# Altium schematic sheet AddressBUS.SchDoc
size A0; SheetNumber: 9; SheetTotal: 9
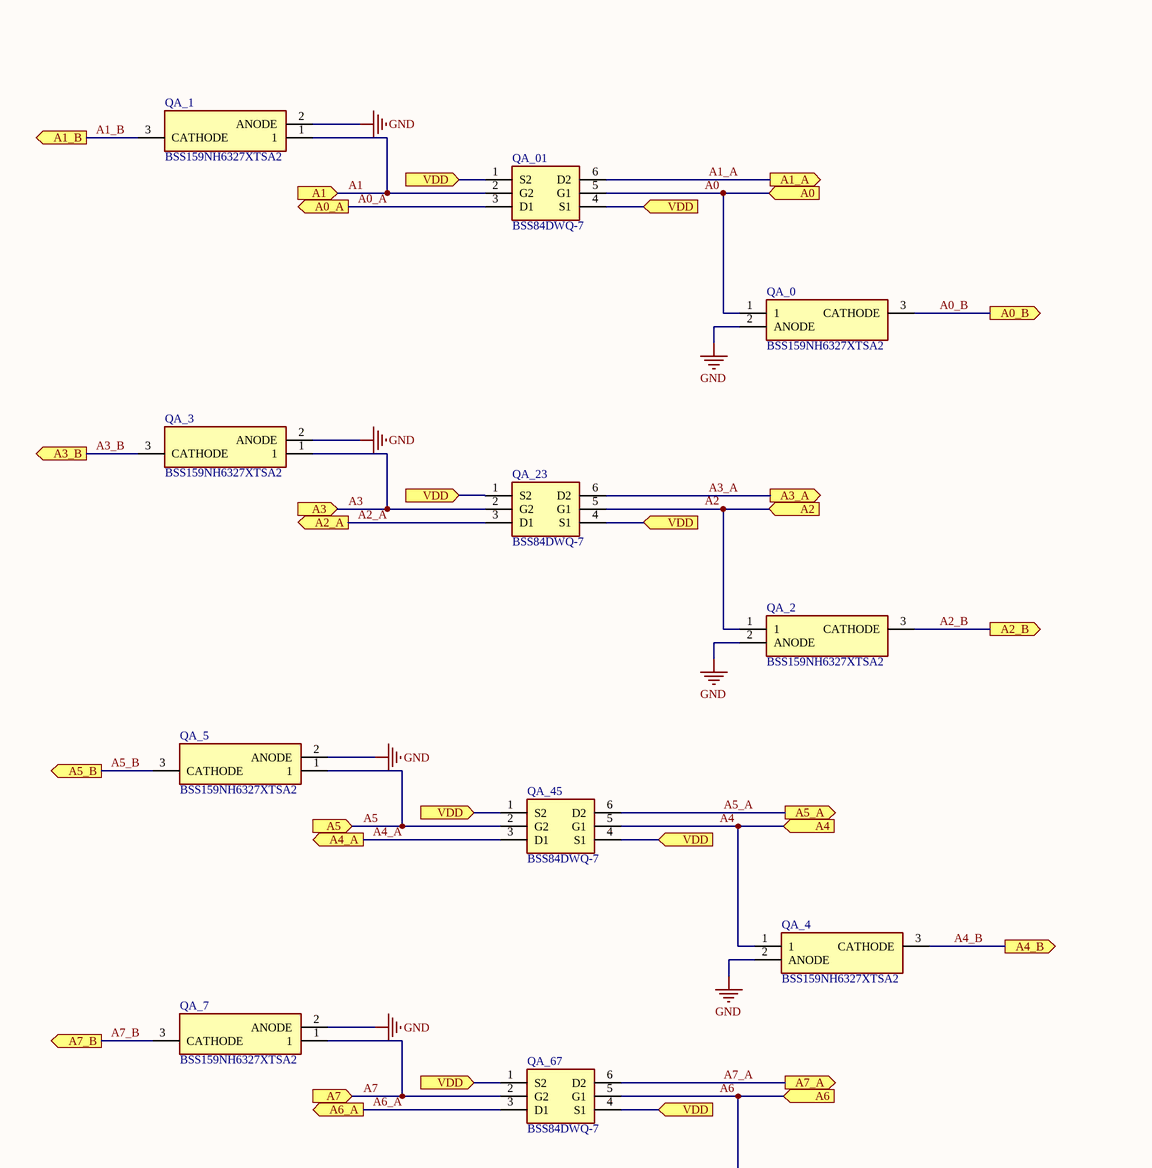
[diagram p0: AddressBUS.SchDoc, top left]
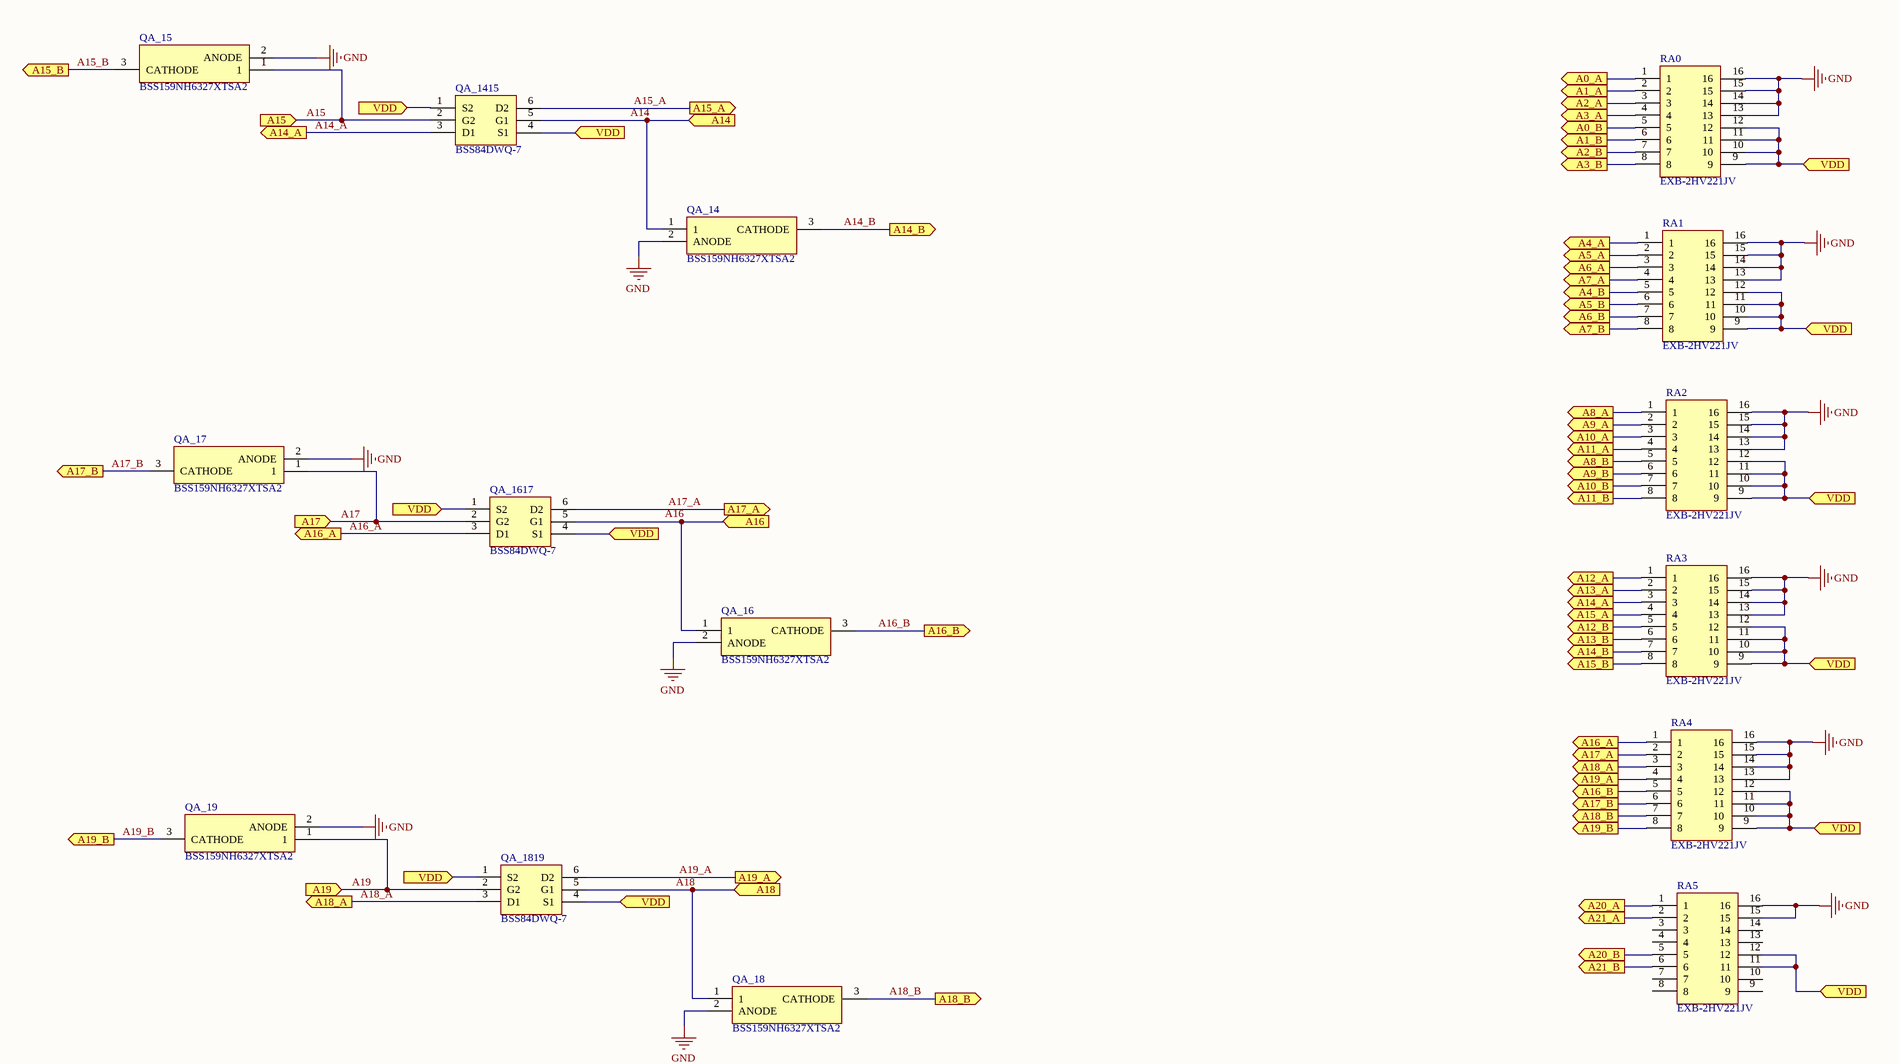
[diagram p1: AddressBUS.SchDoc, top right]
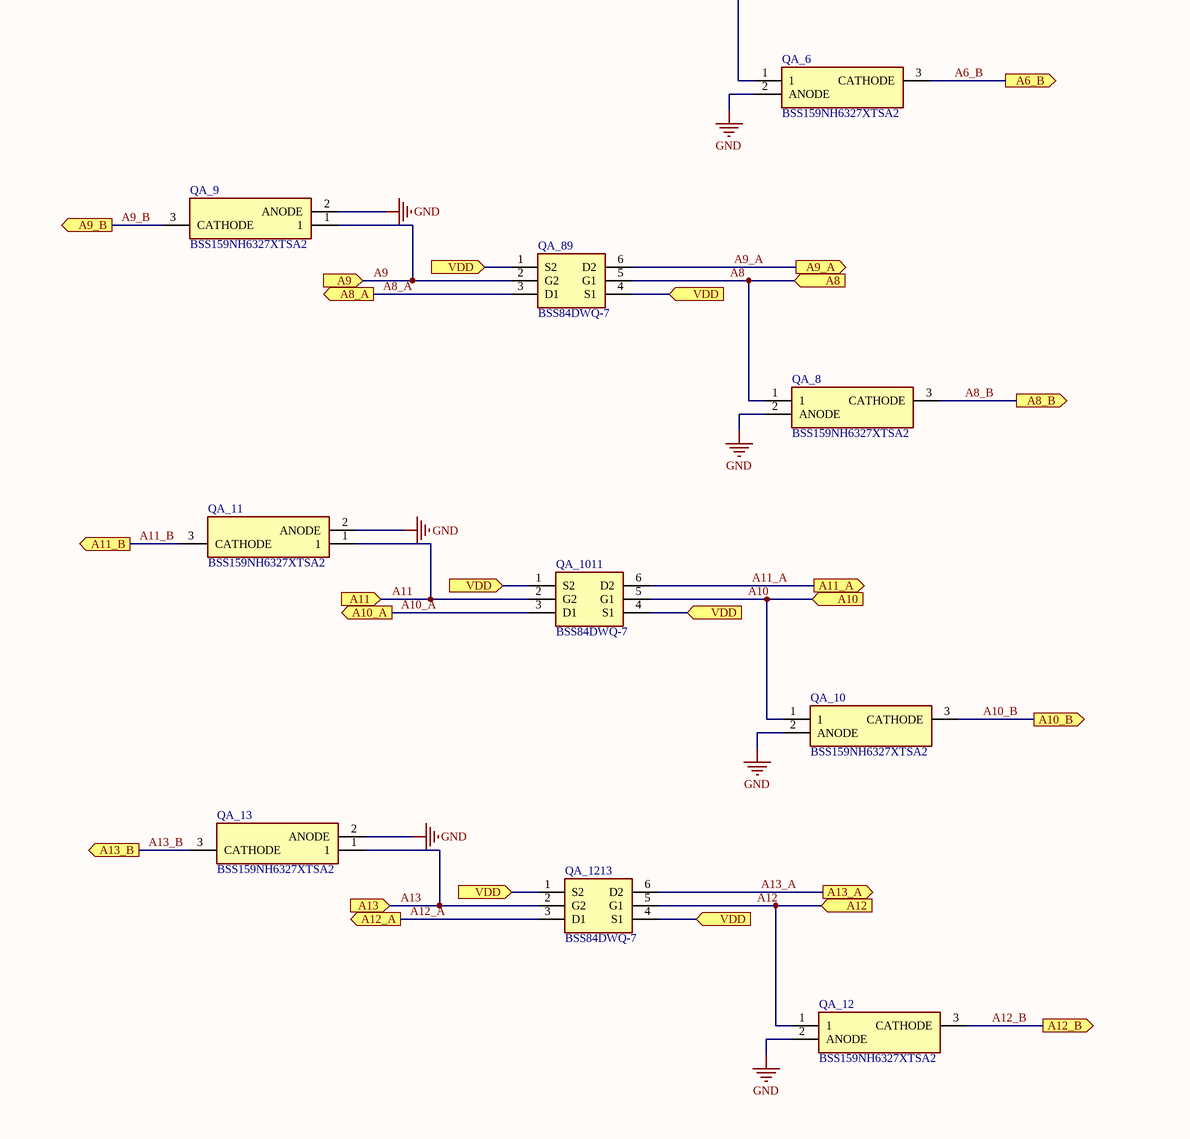
[diagram p2: AddressBUS.SchDoc, bottom left]
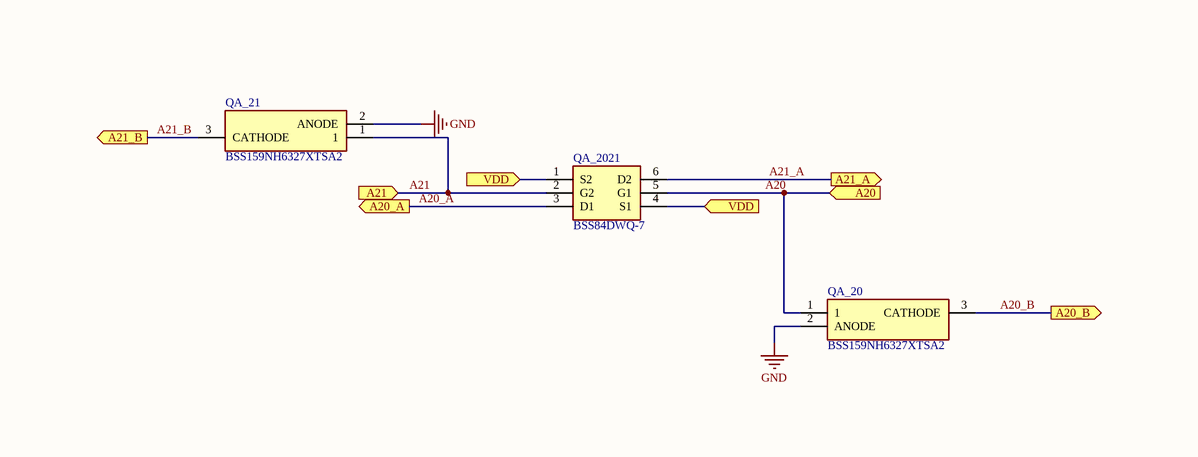
[diagram p3: AddressBUS.SchDoc, bottom right]

## Parts
QA_0  BSS159NH6327XTSA2  [SOT95P260X110-3N]
QA_01  BSS84DWQ-7  [SOT65P210X110-6N]
QA_1  BSS159NH6327XTSA2  [SOT95P260X110-3N]
QA_2  BSS159NH6327XTSA2  [SOT95P260X110-3N]
QA_3  BSS159NH6327XTSA2  [SOT95P260X110-3N]
QA_4  BSS159NH6327XTSA2  [SOT95P260X110-3N]
QA_5  BSS159NH6327XTSA2  [SOT95P260X110-3N]
QA_6  BSS159NH6327XTSA2  [SOT95P260X110-3N]
QA_7  BSS159NH6327XTSA2  [SOT95P260X110-3N]
QA_8  BSS159NH6327XTSA2  [SOT95P260X110-3N]
QA_9  BSS159NH6327XTSA2  [SOT95P260X110-3N]
QA_10  BSS159NH6327XTSA2  [SOT95P260X110-3N]
QA_11  BSS159NH6327XTSA2  [SOT95P260X110-3N]
QA_12  BSS159NH6327XTSA2  [SOT95P260X110-3N]
QA_13  BSS159NH6327XTSA2  [SOT95P260X110-3N]
QA_14  BSS159NH6327XTSA2  [SOT95P260X110-3N]
QA_15  BSS159NH6327XTSA2  [SOT95P260X110-3N]
QA_16  BSS159NH6327XTSA2  [SOT95P260X110-3N]
QA_17  BSS159NH6327XTSA2  [SOT95P260X110-3N]
QA_18  BSS159NH6327XTSA2  [SOT95P260X110-3N]
QA_19  BSS159NH6327XTSA2  [SOT95P260X110-3N]
QA_20  BSS159NH6327XTSA2  [SOT95P260X110-3N]
QA_21  BSS159NH6327XTSA2  [SOT95P260X110-3N]
QA_23  BSS84DWQ-7  [SOT65P210X110-6N]
QA_45  BSS84DWQ-7  [SOT65P210X110-6N]
QA_67  BSS84DWQ-7  [SOT65P210X110-6N]
QA_89  BSS84DWQ-7  [SOT65P210X110-6N]
QA_1011  BSS84DWQ-7  [SOT65P210X110-6N]
QA_1213  BSS84DWQ-7  [SOT65P210X110-6N]
QA_1415  BSS84DWQ-7  [SOT65P210X110-6N]
QA_1617  BSS84DWQ-7  [SOT65P210X110-6N]
QA_1819  BSS84DWQ-7  [SOT65P210X110-6N]
QA_2021  BSS84DWQ-7  [SOT65P210X110-6N]
RA0  EXB-2HV221JV  [EXB2HV221JV]
RA1  EXB-2HV221JV  [EXB2HV221JV]
RA2  EXB-2HV221JV  [EXB2HV221JV]
RA3  EXB-2HV221JV  [EXB2HV221JV]
RA4  EXB-2HV221JV  [EXB2HV221JV]
RA5  EXB-2HV221JV  [EXB2HV221JV]

## Ports
A0 (in), A0_A (out), A0_B (out), A1 (in), A1_A (out), A1_B (out), A2 (in), A2_A (out), A2_B (out), A3 (in), A3_A (out), A3_B (out), A4 (in), A4_A (out), A4_B (out), A5 (in), A5_A (out), A5_B (out), A6 (in), A6_A (out), A6_B (out), A7 (in), A7_A (out), A7_B (out), A8 (in), A8_A (out), A8_B (out), A9 (in), A9_A (out), A9_B (out), A10 (in), A10_A (out), A10_B (out), A11 (in), A11_A (out), A11_B (out), A12 (in), A12_A (out), A12_B (out), A13 (in), A13_A (out), A13_B (out), A14 (in), A14_A (out), A14_B (out), A15 (in), A15_A (out), A15_B (out), A16 (in), A16_A (out), A16_B (out), A17 (in), A17_A (out), A17_B (out), A18 (in), A18_A (out), A18_B (out), A19 (in), A19_A (out), A19_B (out), A20 (in), A20_A (out), A20_B (out), A21 (in), A21_A (out), A21_B (out), VDD (in)

## Nets
GND: QA_0.2(ANODE) QA_1.2(ANODE) QA_2.2(ANODE) QA_3.2(ANODE) QA_4.2(ANODE) QA_5.2(ANODE) QA_6.2(ANODE) QA_7.2(ANODE) QA_8.2(ANODE) QA_9.2(ANODE) QA_10.2(ANODE) QA_11.2(ANODE) QA_12.2(ANODE) QA_13.2(ANODE) QA_14.2(ANODE) QA_15.2(ANODE) QA_16.2(ANODE) QA_17.2(ANODE) QA_18.2(ANODE) QA_19.2(ANODE) QA_20.2(ANODE) QA_21.2(ANODE) RA0.13 RA0.14 RA0.15 RA0.16 RA1.13 RA1.14 RA1.15 RA1.16 RA2.13 RA2.14 RA2.15 RA2.16 RA3.13 RA3.14 RA3.15 RA3.16 RA4.13 RA4.14 RA4.15 RA4.16 RA5.15 RA5.16
A0: QA_0.1 QA_01.5(G1) ; port A0
A0_A: QA_01.3(D1) RA0.1 ; port A0_A
A0_B: QA_0.3(CATHODE) RA0.5 ; port A0_B
A1: QA_1.1 QA_01.2(G2) ; port A1
A1_A: QA_01.6(D2) RA0.2 ; port A1_A
A1_B: QA_1.3(CATHODE) RA0.6 ; port A1_B
A2: QA_2.1 QA_23.5(G1) ; port A2
A2_A: QA_23.3(D1) RA0.3 ; port A2_A
A2_B: QA_2.3(CATHODE) RA0.7 ; port A2_B
A3: QA_3.1 QA_23.2(G2) ; port A3
A3_A: QA_23.6(D2) RA0.4 ; port A3_A
A3_B: QA_3.3(CATHODE) RA0.8 ; port A3_B
A4: QA_4.1 QA_45.5(G1) ; port A4
A4_A: QA_45.3(D1) RA1.1 ; port A4_A
A4_B: QA_4.3(CATHODE) RA1.5 ; port A4_B
A5: QA_5.1 QA_45.2(G2) ; port A5
A5_A: QA_45.6(D2) RA1.2 ; port A5_A
A5_B: QA_5.3(CATHODE) RA1.6 ; port A5_B
A6: QA_6.1 QA_67.5(G1) ; port A6
A6_A: QA_67.3(D1) RA1.3 ; port A6_A
A6_B: QA_6.3(CATHODE) RA1.7 ; port A6_B
A7: QA_7.1 QA_67.2(G2) ; port A7
A7_A: QA_67.6(D2) RA1.4 ; port A7_A
A7_B: QA_7.3(CATHODE) RA1.8 ; port A7_B
A8: QA_8.1 QA_89.5(G1) ; port A8
A8_A: QA_89.3(D1) RA2.1 ; port A8_A
A8_B: QA_8.3(CATHODE) RA2.5 ; port A8_B
A9: QA_9.1 QA_89.2(G2) ; port A9
A9_A: QA_89.6(D2) RA2.2 ; port A9_A
A9_B: QA_9.3(CATHODE) RA2.6 ; port A9_B
A10: QA_10.1 QA_1011.5(G1) ; port A10
A10_A: QA_1011.3(D1) RA2.3 ; port A10_A
A10_B: QA_10.3(CATHODE) RA2.7 ; port A10_B
A11: QA_11.1 QA_1011.2(G2) ; port A11
A11_A: QA_1011.6(D2) RA2.4 ; port A11_A
A11_B: QA_11.3(CATHODE) RA2.8 ; port A11_B
A12: QA_12.1 QA_1213.5(G1) ; port A12
A12_A: QA_1213.3(D1) RA3.1 ; port A12_A
A12_B: QA_12.3(CATHODE) RA3.5 ; port A12_B
A13: QA_13.1 QA_1213.2(G2) ; port A13
A13_A: QA_1213.6(D2) RA3.2 ; port A13_A
A13_B: QA_13.3(CATHODE) RA3.6 ; port A13_B
A14: QA_14.1 QA_1415.5(G1) ; port A14
A14_A: QA_1415.3(D1) RA3.3 ; port A14_A
A14_B: QA_14.3(CATHODE) RA3.7 ; port A14_B
A15: QA_15.1 QA_1415.2(G2) ; port A15
A15_A: QA_1415.6(D2) RA3.4 ; port A15_A
A15_B: QA_15.3(CATHODE) RA3.8 ; port A15_B
A16: QA_16.1 QA_1617.5(G1) ; port A16
A16_A: QA_1617.3(D1) RA4.1 ; port A16_A
A16_B: QA_16.3(CATHODE) RA4.5 ; port A16_B
A17: QA_17.1 QA_1617.2(G2) ; port A17
A17_A: QA_1617.6(D2) RA4.2 ; port A17_A
A17_B: QA_17.3(CATHODE) RA4.6 ; port A17_B
A18: QA_18.1 QA_1819.5(G1) ; port A18
A18_A: QA_1819.3(D1) RA4.3 ; port A18_A
A18_B: QA_18.3(CATHODE) RA4.7 ; port A18_B
A19: QA_19.1 QA_1819.2(G2) ; port A19
A19_A: QA_1819.6(D2) RA4.4 ; port A19_A
A19_B: QA_19.3(CATHODE) RA4.8 ; port A19_B
A20: QA_20.1 QA_2021.5(G1) ; port A20
A20_A: QA_2021.3(D1) RA5.1 ; port A20_A
A20_B: QA_20.3(CATHODE) RA5.5 ; port A20_B
A21: QA_21.1 QA_2021.2(G2) ; port A21
A21_A: QA_2021.6(D2) RA5.2 ; port A21_A
A21_B: QA_21.3(CATHODE) RA5.6 ; port A21_B
VDD: QA_01.1(S2) QA_01.4(S1) QA_23.1(S2) QA_23.4(S1) QA_45.1(S2) QA_45.4(S1) QA_67.1(S2) QA_67.4(S1) QA_89.1(S2) QA_89.4(S1) QA_1011.1(S2) QA_1011.4(S1) QA_1213.1(S2) QA_1213.4(S1) QA_1415.1(S2) QA_1415.4(S1) QA_1617.1(S2) QA_1617.4(S1) QA_1819.1(S2) QA_1819.4(S1) QA_2021.1(S2) QA_2021.4(S1) RA0.9 RA0.10 RA0.11 RA0.12 RA1.9 RA1.10 RA1.11 RA1.12 RA2.9 RA2.10 RA2.11 RA2.12 RA3.9 RA3.10 RA3.11 RA3.12 RA4.9 RA4.10 RA4.11 RA4.12 RA5.11 RA5.12 ; port VDD

Not connected (* = marked no-connect by the designer): RA5 3 4 7 8 9 10 13 14

## Library data of the parts
QA_0-QA_21 = BSS159NH6327XTSA2: Transistor; Manufacturer_Name: Infineon; Datasheet Link: http://www.infineon.com/dgdl/Infineon-BSS159N-DS-v02_02-en.pdf?fileId=db3a304330f68606013108d8b2230036; Height: 1.1mm; Manufacturer_Part_Number: BSS159NH6327XTSA2; Mouser Part Number: 726-BSS159NH6327XTSA; Mouser Price/Stock: https://www.mouser.co.uk/ProductDetail/Infineon-Technologies/BSS159NH6327XTSA2?qs=K00xGehIljvJjqRECkxDcQ%3D%3D; Arrow Part Number: BSS159NH6327XTSA2; Arrow Price/Stock: https://www.arrow.com/en/products/bss159nh6327xtsa2/infineon-technologies-ag?region=nac
QA_01 QA_23 QA_45 QA_67 QA_89 QA_1011 QA_1213 QA_1415 QA_1617 QA_1819 QA_2021 = BSS84DWQ-7: Transistor; Manufacturer_Name: Diodes Inc.; Datasheet Link: https://www.diodes.com/assets/Datasheets/BSS84DWQ.pdf; Height: 1.1mm; Manufacturer_Part_Number: BSS84DWQ-7; Mouser Part Number: 621-BSS84DWQ-7; Mouser Price/Stock: https://www.mouser.co.uk/ProductDetail/Diodes-Incorporated/BSS84DWQ-7?qs=W%2FMpXkg%252BdQ4tYNQw8VopWw%3D%3D; Arrow Part Number: BSS84DWQ-7; Arrow Price/Stock: https://www.arrow.com/en/products/bss84dwq-7/diodes-incorporated
RA0-RA5 = EXB-2HV221JV: Resistor Network; Manufacturer_Name: Panasonic; Datasheet Link: https://industrial.panasonic.com/cdbs/www-data/pdf/AOC0000/AOC0000C14.pdf; Height: 0.55mm; Manufacturer_Part_Number: EXB-2HV221JV; Mouser Part Number: 667-EXB-2HV221JV; Mouser Price/Stock: https://www.mouser.co.uk/ProductDetail/Panasonic/EXB-2HV221JV?qs=LZJzOuaToaVYOp9V2U%2F1Gw%3D%3D; Arrow Part Number: EXB-2HV221JV; Arrow Price/Stock: https://www.arrow.com/en/products/exb-2hv221jv/panasonic?region=europe